# Altium schematic sheet USB.SchDoc
size 220 x 165 mm
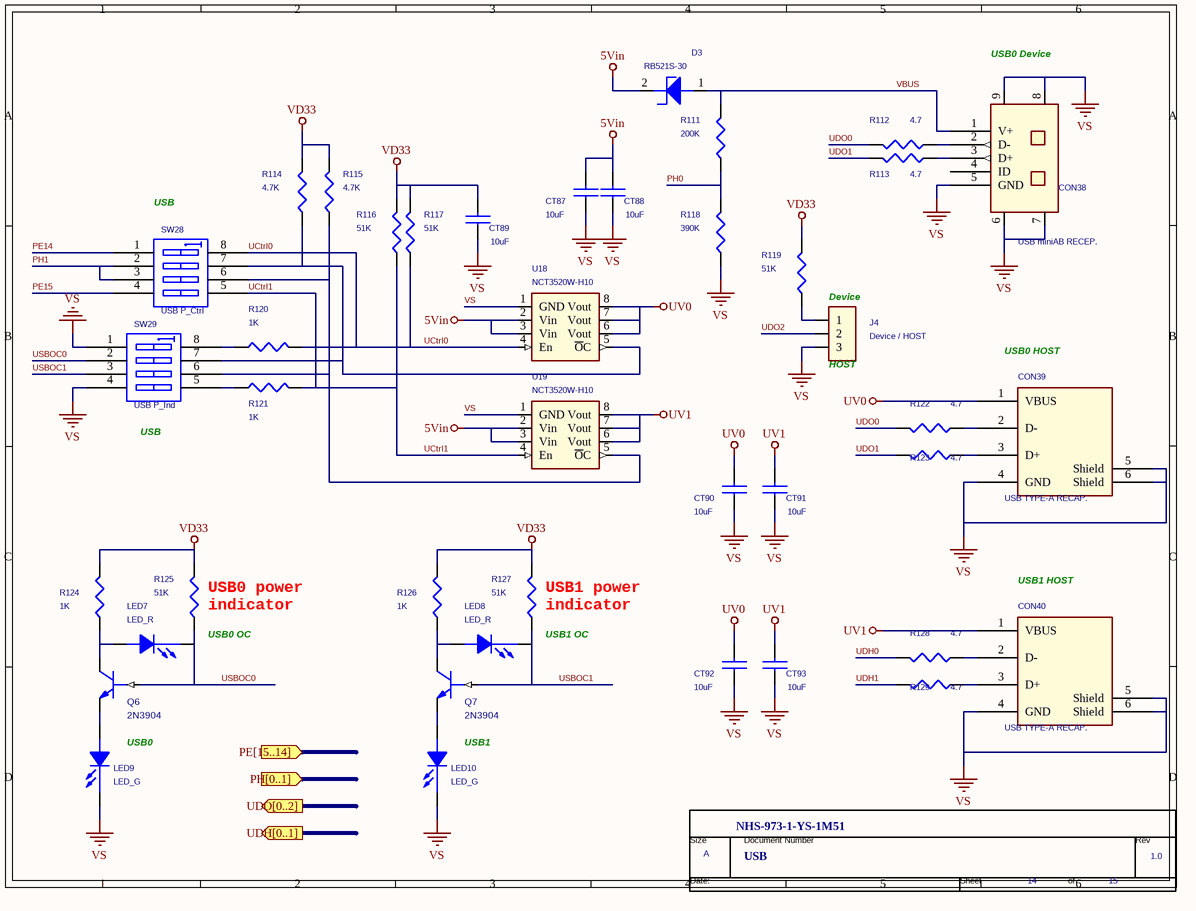
[diagram p0: USB.SchDoc]

## Parts
*  RevCode: 1.0  Page Size: A  Page Number: 14  Page Count: 15  Doc: USB  OrgName: NHS-973-1-YS-1M51  (hidden comment: TitleBlock0N)  (graphical)
CON38  USB miniAB RECEP.  [9]
CON39  USB TYPE-A RECAP.  [USB4P]
CON40  USB TYPE-A RECAP.  [USB4P]
CT87  10uF  [C0603]
CT88  10uF  [C0603]
CT89  10uF  [C0603]
CT90  10uF  [C0603]
CT91  10uF  [C0603]
CT92  10uF  [C0603]
CT93  10uF  [C0603]
D3  RB521S-30  [SOD-523]
J4  Device / HOST  [Header_3x1_2.54mm]
LED7  LED_R  [LED_0603]
LED8  LED_R  [LED_0603]
LED9  LED_G  [LED_0603]
LED10  LED_G  [LED_0603]
Q6  2N3904  [SOT23-BEC]
Q7  2N3904  [SOT23-BEC]
R111  200K  [R0603]
R112  4.7  [R0603]
R113  4.7  [R0603]
R114  4.7K  [R0603]
R115  4.7K  [R0603]
R116  51K  [R0603]
R117  51K  [R0603]
R118  390K  [R0603]
R119  51K  [R0603]
R120  1K  [R0603]
R121  1K  [R0603]
R122  4.7  [R0603]
R123  4.7  [R0603]
R124  1K  [R0603]
R125  51K  [R0603]
R126  1K  [R0603]
R127  51K  [R0603]
R128  4.7  [R0603]
R129  4.7  [R0603]
SW28  USB P_Ctrl  [DIPSWx4_2.54mm]
SW29  USB P_Ind  [DIPSWx4_2.54mm]
U18  NCT3520W-H10  [MSOP-8]
U19  NCT3520W-H10  [MSOP-8]

## Ports
PE[15..14] (in), PH[0..1] (in), UDH[0..1] (out), UDO[0..2] (out)

## Nets
5Vin: CT87.2 CT88.2 D3.2 U18.2(Vin) U18.3(Vin) U19.2(Vin) U19.3(Vin)
UV0: CON39.1(VBUS) CT90.2 CT92.2 U18.6(Vout) U18.7(Vout) U18.8(Vout)
UV1: CON40.1(VBUS) CT91.2 CT93.2 U19.6(Vout) U19.7(Vout) U19.8(Vout)
VD33: CT89.2 R114.2 R115.2 R116.2 R117.2 R119.2 R124.2 R125.2 R126.2 R127.2
VS: CON38.5(GND) CON38.6(\) CON38.7(\) CON38.8(\) CON38.9(\) CON39.4(GND) CON39.5(Shield) CON39.6(Shield) CON40.4(GND) CON40.5(Shield) CON40.6(Shield) CT87.1 CT88.1 CT89.1 CT90.1 CT91.1 CT92.1 CT93.1 J4.3 LED9.2(CATHODE) LED10.2(CATHODE) R118.1 SW29.1(A1) SW29.4(A4) U18.1(GND) U19.1(GND)
PE14: SW28.1(A1)
PE15: SW28.4(A4)
PH0: R111.1 R118.2
PH1: SW28.2(A2) SW28.3(A3)
UCtrl0: R117.1 R120.1 SW28.8(B1) U18.4(En)
UCtrl1: R116.1 R121.1 SW28.5(B4) U19.4(En)
UDH0: R128.2
UDH1: R129.2
UDO0: R112.2 R122.2
UDO1: R113.2 R123.2
UDO2: J4.2
USBOC0: LED7.2(CATHODE) Q6.B R125.1 SW29.2(A2)
USBOC1: LED8.2(CATHODE) Q7.B R127.1 SW29.3(A3)
VBUS: CON38.1(V+) D3.1 R111.2
NetCON38_2: CON38.2(D-) R112.1
NetCON38_3: CON38.3(D+) R113.1
NetCON39_2: CON39.2(D-) R122.1
NetCON39_3: CON39.3(D+) R123.1
NetCON40_2: CON40.2(D-) R128.1
NetCON40_3: CON40.3(D+) R129.1
NetJ4_1: J4.1 R119.1
NetLED7_1: LED7.1(ANODE) Q6.C R124.1
NetLED8_1: LED8.1(ANODE) Q7.C R126.1
NetLED9_1: LED9.1(ANODE) Q6.E
NetLED10_1: LED10.1(ANODE) Q7.E
NetR114_1: R114.1 SW28.7(B2) SW29.7(B2) U18.5(~{O}C)
NetR115_1: R115.1 SW28.6(B3) SW29.6(B3) U19.5(~{O}C)
NetR120_2: R120.2 SW29.8(B1)
NetR121_2: R121.2 SW29.5(B4)

Not connected (* = marked no-connect by the designer): CON38 4(ID)

## Notes on the sheet
- (near CON38) USB0 Device
- (near SW28) USB
- Device
- (near J4) HOST
- (near CON39) USB0 HOST
- (near SW29) USB
- (near R125) USB0 power
  indicator
- (near R127) USB1 power
  indicator
- USB0 OC
- USB1 OC
- (near CON40) USB1 HOST
- USB0
- USB1
- (in symbol TitleBlock0N) Size; Document Number; Rev; Date:; Sheet; of

## Library data of the parts
CON38 = USB Type B_0
CON39 CON40 = USB type_A connector
CT87-CT93 = CAP NP
D3 = ZENAR_0: Package: D
J4 = CON3
LED7-LED10 = LED
Q6 Q7 = NPN_1
R111-R129 = R
SW28 = SW DIP-4_4
SW29 = SW DIP-4
* = TitleBlock0N: Page Create Date: April 25, 1995